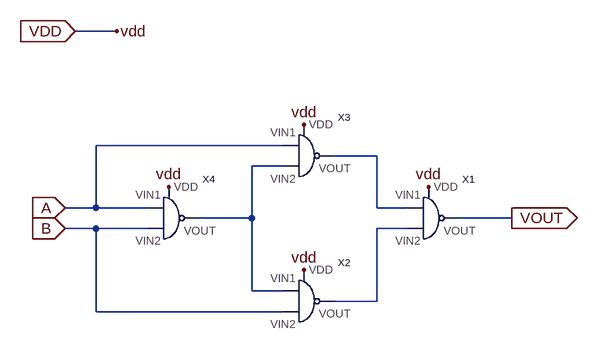
[diagram p0: schematic xor.asc]
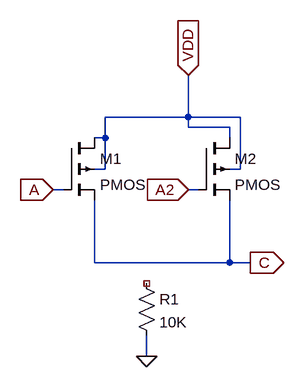
[diagram p1: sub-circuit nand.asc]
xor.asc, the LTspice schematic file:
Version 4
SHEET 1 880 680
WIRE -304 -176 -368 -176
WIRE -48 0 -336 0
WIRE 96 16 32 16
WIRE -48 32 -96 32
WIRE -336 96 -336 0
WIRE -336 96 -384 96
WIRE -256 96 -336 96
WIRE 96 96 96 16
WIRE 144 96 96 96
WIRE -96 112 -96 32
WIRE -96 112 -176 112
WIRE 304 112 224 112
WIRE -336 128 -384 128
WIRE -256 128 -336 128
WIRE 144 128 96 128
WIRE -96 224 -96 112
WIRE -48 224 -96 224
WIRE 96 240 96 128
WIRE 96 240 32 240
WIRE -336 256 -336 128
WIRE -48 256 -336 256
FLAG -384 96 A
IOPIN -384 96 In
FLAG -384 128 B
IOPIN -384 128 In
FLAG -368 -176 VDD
IOPIN -368 -176 In
FLAG -304 -176 vdd
FLAG -16 -32 vdd
FLAG -224 64 vdd
FLAG -16 192 vdd
FLAG 176 64 vdd
FLAG 304 112 VOUT
IOPIN 304 112 Out
SYMBOL nand 176 112 R0
SYMATTR InstName X1
SYMBOL nand -16 240 R0
SYMATTR InstName X2
SYMBOL nand -16 16 R0
SYMATTR InstName X3
SYMBOL nand -224 112 R0
SYMATTR InstName X4

nand.asc, the sub-circuit schematic file:
Version 4
SHEET 1 880 680
WIRE 256 80 256 16
WIRE 256 80 128 80
WIRE 336 80 256 80
WIRE 256 96 256 80
WIRE 320 96 256 96
WIRE 128 112 128 80
WIRE 128 112 112 112
WIRE 320 112 320 96
WIRE 128 160 128 112
WIRE 128 160 112 160
WIRE 336 160 336 80
WIRE 336 160 320 160
WIRE 64 192 48 192
WIRE 272 192 256 192
WIRE 112 304 112 208
WIRE 320 304 112 304
WIRE 320 304 320 208
WIRE 352 304 320 304
WIRE 192 448 192 416
FLAG 48 192 A
IOPIN 48 192 In
FLAG 256 192 A2
IOPIN 256 192 In
FLAG 192 448 0
FLAG 352 304 C
IOPIN 352 304 Out
FLAG 256 16 VDD
IOPIN 256 16 In
SYMBOL pmos4 64 112 R0
SYMATTR InstName M1
SYMBOL pmos4 272 112 R0
SYMATTR InstName M2
SYMBOL res 176 320 R0
SYMATTR InstName R1
SYMATTR Value 10K

The netlist it stands for:
* xor.asc
XX1 N001 N003 VOUT VDD nand
XX2 N002 B N003 VDD nand
XX3 A N002 N001 VDD nand
XX4 A B N002 VDD nand

* block symbol definitions
.subckt nand VIN1 VIN2 VOUT VDD
M1 VDD A C VDD PMOS
M2 VDD A2 C VDD PMOS
R1 NC_01 0 10K
.ends nand

.model NMOS NMOS
.model PMOS PMOS
.lib standard.mos
.backanno
.end